# Altium schematic sheet E-39 IPS.SchDoc: E-39 Indoor Positioning System
size B; DrawnBy: Jeremie Boulianne; Organization: Synthiam Inc.; Address1: Unit 10, 6120 - 11 St. SE; Address2: Calgary, AB; Address3: T2H 2L7; Address4: Canada; Revision: 0
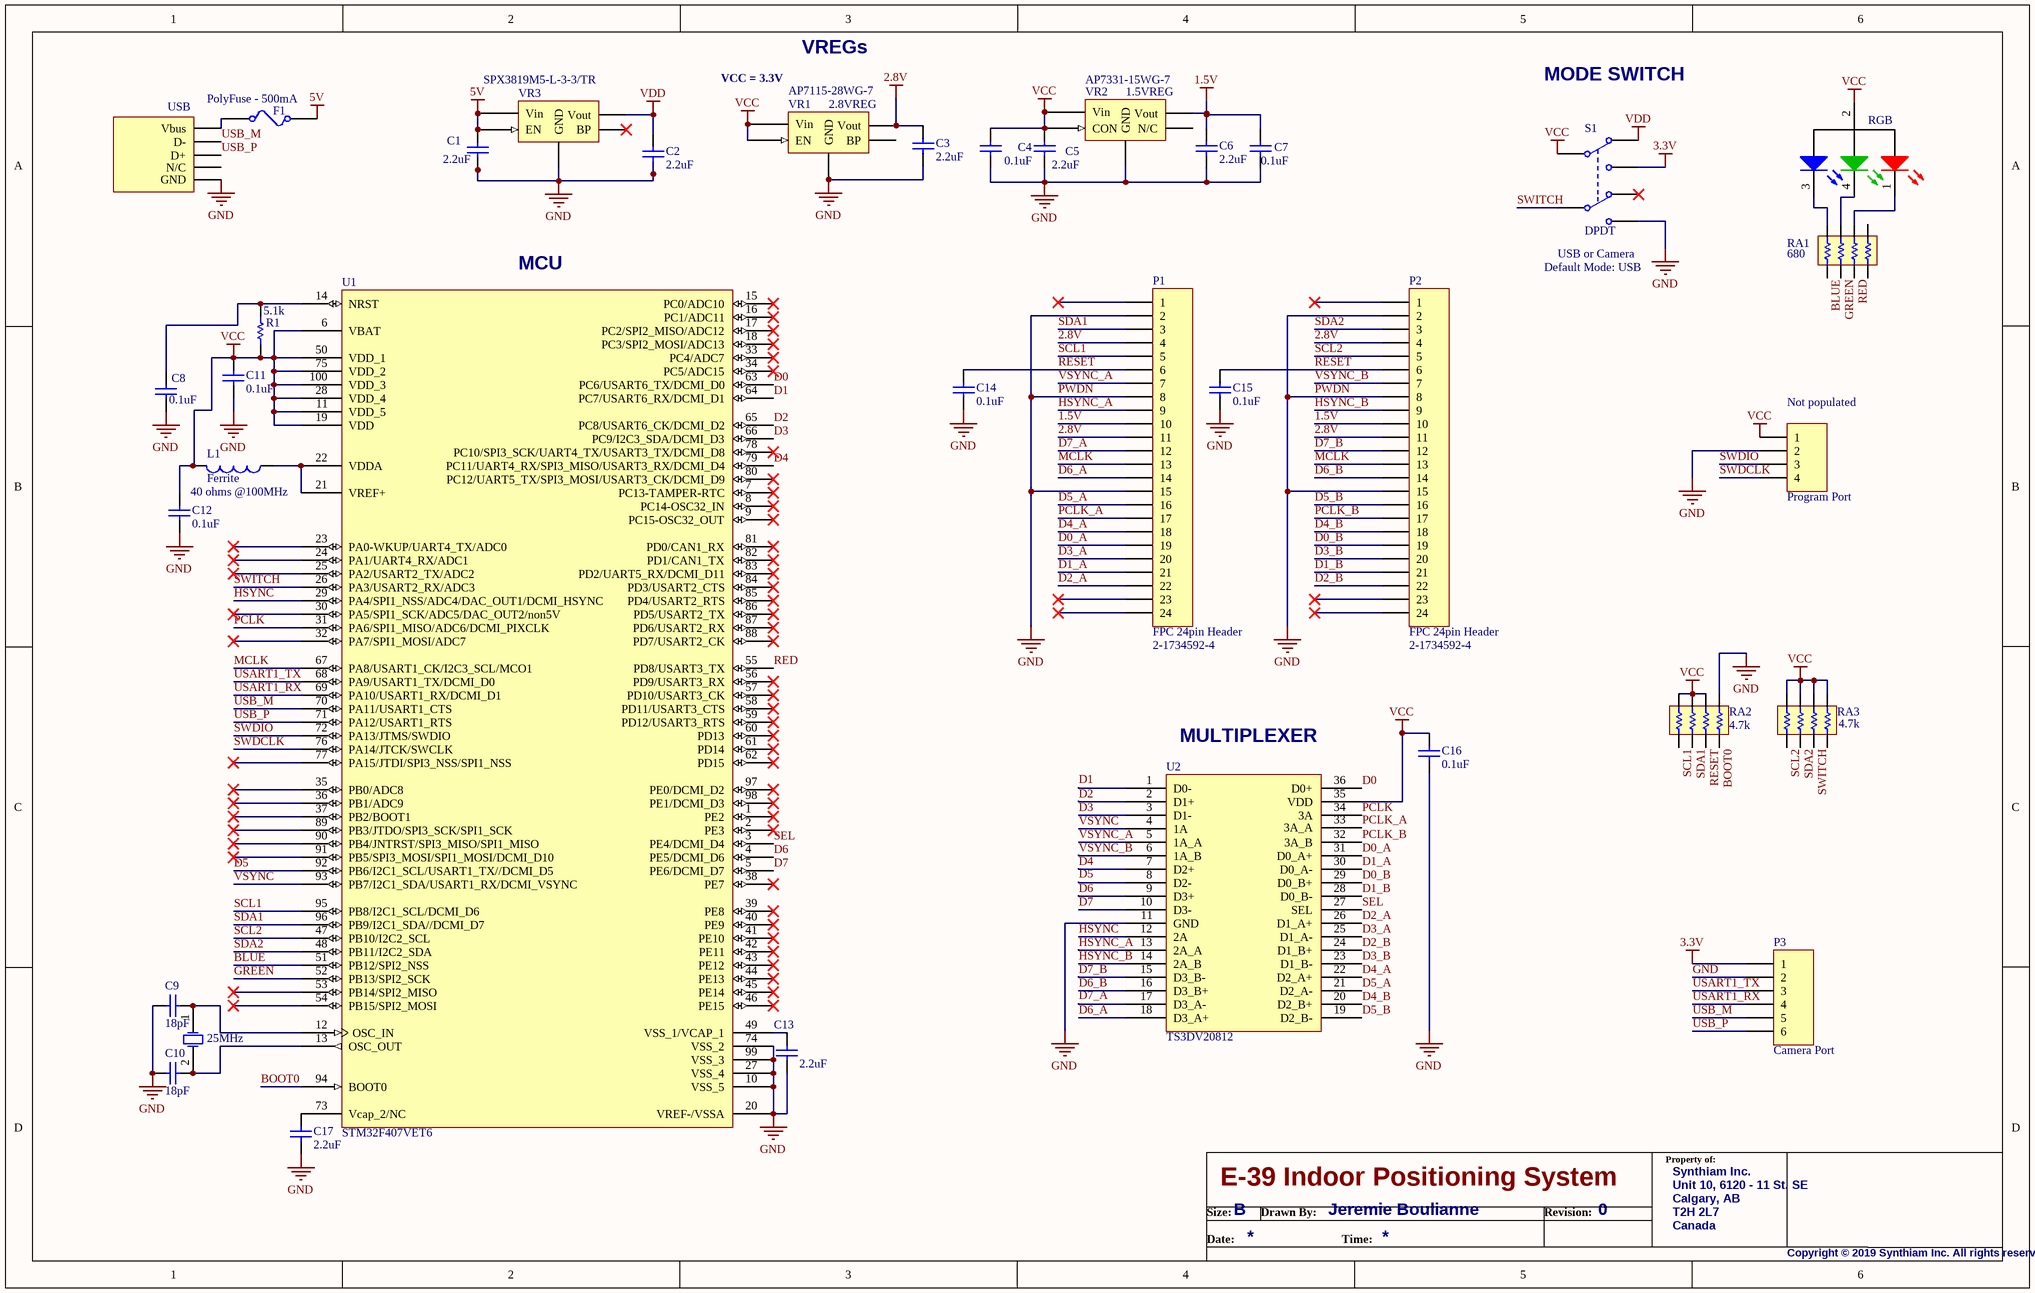
[diagram p0: E-39 IPS.SchDoc]

## Parts
25MHz  XTAL 8MHz  [Crystal]  (value not drawn)
C1  value 2.2uF  [0603 TIGHT]  (hidden comment: Cap)
C2  value 2.2uF  [0603 TIGHT]  (hidden comment: Cap)
C3  2.2uF  [0603 TIGHT]
C4  value 0.1uF  [0603 TIGHT]  (hidden comment: 2.2uF)
C5  2.2uF  [0603 TIGHT]
C6  2.2uF  [0603 TIGHT]
C7  value 0.1uF  [0603 TIGHT]  (hidden comment: 100nF)
C8  value 0.1uF  [0603 TIGHT]  (hidden comment: 100nF)
C9  18pF  [0603 TIGHT]
C10  18pF  [0603 TIGHT]
C11  value 0.1uF  [0603 TIGHT]  (hidden comment: 100nF)
C12  value 0.1uF  [0603 TIGHT]  (hidden comment: 100nF)
C13  2.2uF  [0603 TIGHT]
C14  value 0.1uF  [0603 TIGHT]  (hidden comment: 18pF)
C15  value 0.1uF  [0603 TIGHT]  (hidden comment: 18pF)
C16  value 0.1uF  [0603 TIGHT]  (hidden comment: 18pF)
C17  2.2uF  [0603 TIGHT]
F1  PolyFuse - 500mA  [1206]
L1  Ferrite  value 40 ohms @100MHz  [0603 tight]
P1  FPC 24pin Header  [FPC Connector 24pin]
P2  FPC 24pin Header  [FPC Connector 24pin]
P3  Camera Port  [JST-PH 6pin]
Program_Port  Not populated  [HDR1X4]
R1  value 5.1k  [0603 TIGHT]  (hidden comment: Res1)
RA1  680  [Resistor Array 4]
RA2  4.7k  [Resistor Array 4]
RA3  4.7k  [Resistor Array 4]
RGB  RGBLED-CA  [RGBLED-CA]  (value not drawn)
S1  DPDT  [SWITCH DPDT SMD]
U1  STM32F407VET6  [LQFP100_M]
U2  TS3DV20812  [QFN-36]
USB  USB Connector  [MICRO USB]  (value not drawn)
VR1  2.8VREG  [SOT-25 New]
VR2  1.5VREG  [SOT-25 New]
VR3  SPX3819M5-L-3-3/TR  [SOT-25]

## Nets
1.5V: C6.1 C7.1 P1.10 P2.10 VR2.2(Vout)
2.8V: C3.1 P1.4 P1.11 P2.4 P2.11 VR1.2(Vout)
3.3V: P3.1 S1.3(NO1)
5V: C1.1 F1.1 VR3.4(EN) VR3.5(Vin)
GND: C1.2 C2.2 C3.2 C4.2 C5.2 C6.2 C7.2 C8.2 C9.2 C10.2 C11.2 C12.1 C13.2 C14.1 C15.1 C16.1 C17.2 P1.2 P1.8 P1.15 P2.2 P2.8 P2.15 P3.2 Program_Port.2 RA2.8 S1.6(NO2) U1.10(VSS_5) U1.20(VREF-/VSSA) U1.27(VSS_4) U1.74(VSS_2) U1.99(VSS_3) U2.11(GND) USB.5(GND) VR1.3(GND) VR2.3(GND) VR3.3(GND)  [also labelled PWDN]
VCC: C4.1 C5.1 C11.1 C12.2 C16.2 L1.2 Program_Port.1 R1.2 RA2.2 RA2.4 RA2.6 RA3.2 RA3.4 RA3.6 RA3.8 RGB.2 S1.2(COMMON1) U1.6(VBAT) U1.11(VDD_5) U1.19(VDD) U1.28(VDD_4) U1.50(VDD_1) U1.75(VDD_2) U1.100(VDD_3) U2.35(VDD) VR1.4(EN) VR1.5(Vin) VR2.4(CON) VR2.5(Vin)
VDD: C2.1 S1.1(NC1) VR3.2(Vout)
BLUE: RA1.1 U1.51(PB12/SPI2_NSS)
BOOT0: RA2.7 U1.94(BOOT0)
D0: U1.63(PC6/USART6_TX/DCMI_D0) U2.36(D0+)
D0_A: P1.19 U2.31(D0_A+)
D0_B: P2.19 U2.29(D0_B+)
D1: U1.64(PC7/USART6_RX/DCMI_D1) U2.1(D0-)
D1_A: P1.21 U2.30(D0_A-)
D1_B: P2.21 U2.28(D0_B-)
D2: U1.65(PC8/USART6_CK/DCMI_D2) U2.2(D1+)
D2_A: P1.22 U2.26(D1_A+)
D2_B: P2.22 U2.24(D1_B+)
D3: U1.66(PC9/I2C3_SDA/DCMI_D3) U2.3(D1-)
D3_A: P1.20 U2.25(D1_A-)
D3_B: P2.20 U2.23(D1_B-)
D4: U1.79(PC11/UART4_RX/SPI3_MISO/USART3_RX/DCMI_D4) U2.7(D2+)
D4_A: P1.18 U2.22(D2_A+)
D4_B: P2.18 U2.20(D2_B+)
D5: U1.92(PB6/I2C1_SCL/USART1_TX//DCMI_D5) U2.8(D2-)
D5_A: P1.16 U2.21(D2_A-)
D5_B: P2.16 U2.19(D2_B-)
D6: U1.4(PE5/DCMI_D6) U2.9(D3+)
D6_A: P1.14 U2.18(D3_A+)
D6_B: P2.14 U2.16(D3_B+)
D7: U1.5(PE6/DCMI_D7) U2.10(D3-)
D7_A: P1.12 U2.17(D3_A-)
D7_B: P2.12 U2.15(D3_B-)
GREEN: RA1.3 U1.52(PB13/SPI2_SCK)
HSYNC: U1.29(PA4/SPI1_NSS/ADC4/DAC_OUT1/DCMI_HSYNC) U2.12(2A)
HSYNC_A: P1.9 U2.13(2A_A)
HSYNC_B: P2.9 U2.14(2A_B)
MCLK: P1.13 P2.13 U1.67(PA8/USART1_CK/I2C3_SCL/MCO1)
PCLK: U1.31(PA6/SPI1_MISO/ADC6/DCMI_PIXCLK) U2.34(3A)
PCLK_A: P1.17 U2.33(3A_A)
PCLK_B: P2.17 U2.32(3A_B)
RED: RA1.5 U1.55(PD8/USART3_TX)
RESET: C14.2 C15.2 P1.6 P2.6 RA2.5
SCL1: P1.5 RA2.1 U1.95(PB8/I2C1_SCL/DCMI_D6)
SCL2: P2.5 RA3.1 U1.47(PB10/I2C2_SCL)
SDA1: P1.3 RA2.3 U1.96(PB9/I2C1_SDA//DCMI_D7)
SDA2: P2.3 RA3.3 U1.48(PB11/I2C2_SDA)
SEL: U1.3(PE4/DCMI_D4) U2.27(SEL)
SWDCLK: Program_Port.4 U1.76(PA14/JTCK/SWCLK)
SWDIO: Program_Port.3 U1.72(PA13/JTMS/SWDIO)
SWITCH: RA3.5 S1.5(COMMON2) U1.26(PA3/USART2_RX/ADC3)
USART1_RX: P3.4 U1.69(PA10/USART1_RX/DCMI_D1)
USART1_TX: P3.3 U1.68(PA9/USART1_TX/DCMI_D0)
USB_M: P3.5 U1.70(PA11/USART1_CTS) USB.2(D-)
USB_P: P3.6 U1.71(PA12/USART1_RTS) USB.3(D+)
VSYNC: U1.93(PB7/I2C1_SDA/USART1_RX/DCMI_VSYNC) U2.4(1A)
VSYNC_A: P1.7 U2.5(1A_A)
VSYNC_B: P2.7 U2.6(1A_B)
Net25MHz_1: 25MHz.1(OSC1) C9.1 U1.12(OSC_IN)
Net25MHz_2: 25MHz.2(OSC2) C10.1 U1.13(OSC_OUT)
NetC8_1: C8.1 R1.1 U1.14(NRST)
NetC13_1: C13.1 U1.49(VSS_1/VCAP_1)
NetC17_1: C17.1 U1.73(Vcap_2/NC)
NetF1_2: F1.2 USB.1(Vbus)
NetL1_1: L1.1 U1.21(VREF+) U1.22(VDDA)
NetRA1_2: RA1.2 RGB.3
NetRA1_4: RA1.4 RGB.4
NetRA1_6: RA1.6 RGB.1

Not connected (* = marked no-connect by the designer): P1 1* 23* 24*; P2 1* 23* 24*; RA1 7 8; RA3 7; S1 4(NC2)*; U1 1(PE2)* 2(PE3)* 7(PC13-TAMPER-RTC)* 8(PC14-OSC32_IN)* 9(PC15-OSC32_OUT)* 15(PC0/ADC10)* 16(PC1/ADC11)* 17(PC2/SPI2_MISO/ADC12)* 18(PC3/SPI2_MOSI/ADC13)* 23(PA0-WKUP/UART4_TX/ADC0)* 24(PA1/UART4_RX/ADC1)* 25(PA2/USART2_TX/ADC2)* 30(PA5/SPI1_SCK/ADC5/DAC_OUT2/non5V)* 32(PA7/SPI1_MOSI/ADC7)* 33(PC4/ADC7)* 34(PC5/ADC15)* 35(PB0/ADC8)* 36(PB1/ADC9)* 37(PB2/BOOT1)* 38(PE7)* 39(PE8)* 40(PE9)* 41(PE10)* 42(PE11)* 43(PE12)* 44(PE13)* 45(PE14)* 46(PE15)* 53(PB14/SPI2_MISO)* 54(PB15/SPI2_MOSI)* 56(PD9/USART3_RX)* 57(PD10/USART3_CK)* 58(PD11/USART3_CTS)* 59(PD12/USART3_RTS)* 60(PD13)* 61(PD14)* 62(PD15)* 77(PA15/JTDI/SPI3_NSS/SPI1_NSS)* 78(PC10/SPI3_SCK/UART4_TX/USART3_TX/DCMI_D8)* 80(PC12/UART5_TX/SPI3_MOSI/USART3_CK/DCMI_D9)* 81(PD0/CAN1_RX)* 82(PD1/CAN1_TX)* 83(PD2/UART5_RX/DCMI_D11)* 84(PD3/USART2_CTS)* 85(PD4/USART2_RTS)* 86(PD5/USART2_TX)* 87(PD6/USART2_RX)* 88(PD7/USART2_CK)* 89(PB3/JTDO/SPI3_SCK/SPI1_SCK)* 90(PB4/JNTRST/SPI3_MISO/SPI1_MISO)* 91(PB5/SPI3_MOSI/SPI1_MOSI/DCMI_D10)* 97(PE0/DCMI_D2)* 98(PE1/DCMI_D3)*; USB 4(N/C); VR1 1(BP); VR2 1(N/C); VR3 1(BP)*

## Notes on the sheet
- (near VR1) VCC = 3.3V
- VREGs
- MODE SWITCH
- (near U1) MCU
- (near S1) Default Mode: USB
- (near S1) USB or Camera
- (near U2) MULTIPLEXER
- Labels drawn without touching a wire or pin: 2-1734592-4, AP7115-28WG-7, AP7331-15WG-7
- Property of:
- Size:
- Date:
- B
- Drawn By:
- Time:
- Revision:
- Copyright © 2019 Synthiam Inc. All rights reserved.

## Library data of the parts
25MHz = XTAL: Crystal Oscillator; Published: 8-Jun-2000; LatestRevisionDate: 17-Jul-2002; LatestRevisionNote: Re-released for DXP Platform.; PackageReference: R38; Publisher: Altium Limited
C1-C17 = Cap: Capacitor; Published: 8-Jun-2000; LatestRevisionDate: 17-Jul-2002; LatestRevisionNote: Re-released for DXP Platform.; PackageReference: RAD-0.3; Publisher: Altium Limited
  C3 C5 C6 C13 C17: Value: 2.2uF
  C9 C10: Value: 18pF
F1 = PolyFuse: PTC .50A 15VDC RESETTABLE 1812L
L1 = Inductor: Code_IEC: 1005; Published: 8-Jun-2000; LatestRevisionDate: 29-May-2009; LatestRevisionNote: IPC-7351 Footprint Added.; PackageReference: 0402-A; Publisher: Altium Limited; PackageDescription: Chip Inductor; Code_JEITA: 0402
P1 P2 = Header 24: Header, 24-Pin; LatestRevisionDate: 17-Jul-2002; LatestRevisionNote: Re-released for DXP Platform.; Publisher: Altium Limited
P3 = Header 6: Header, 6-Pin; LatestRevisionDate: 17-Jul-2002; LatestRevisionNote: Re-released for DXP Platform.; Publisher: Altium Limited
Program_Port = Header 4: LatestRevisionDate: 17-Jul-2002; LatestRevisionNote: Re-released for DXP Platform.; Publisher: Altium Limited
R1 = Res1: Resistor; Published: 8-Jun-2000; LatestRevisionDate: 17-Jul-2002; LatestRevisionNote: Re-released for DXP Platform.; PackageReference: AXIAL-0.3; Publisher: Altium Limited
RA1-RA3 = Resistor Array 4
S1 = SWITCH DPDT
U1 = STM32F2
VR1-VR3 = Vreg SOT25